# Altium schematic sheet 05_OSC_PLL.SchDoc: =title
size A3; Organization: 六零加智能科技; Address4: www.nidone.com.cn; DocumentNumber: kang jin; Revision: 1.0; SheetNumber: 5; SheetTotal: 23
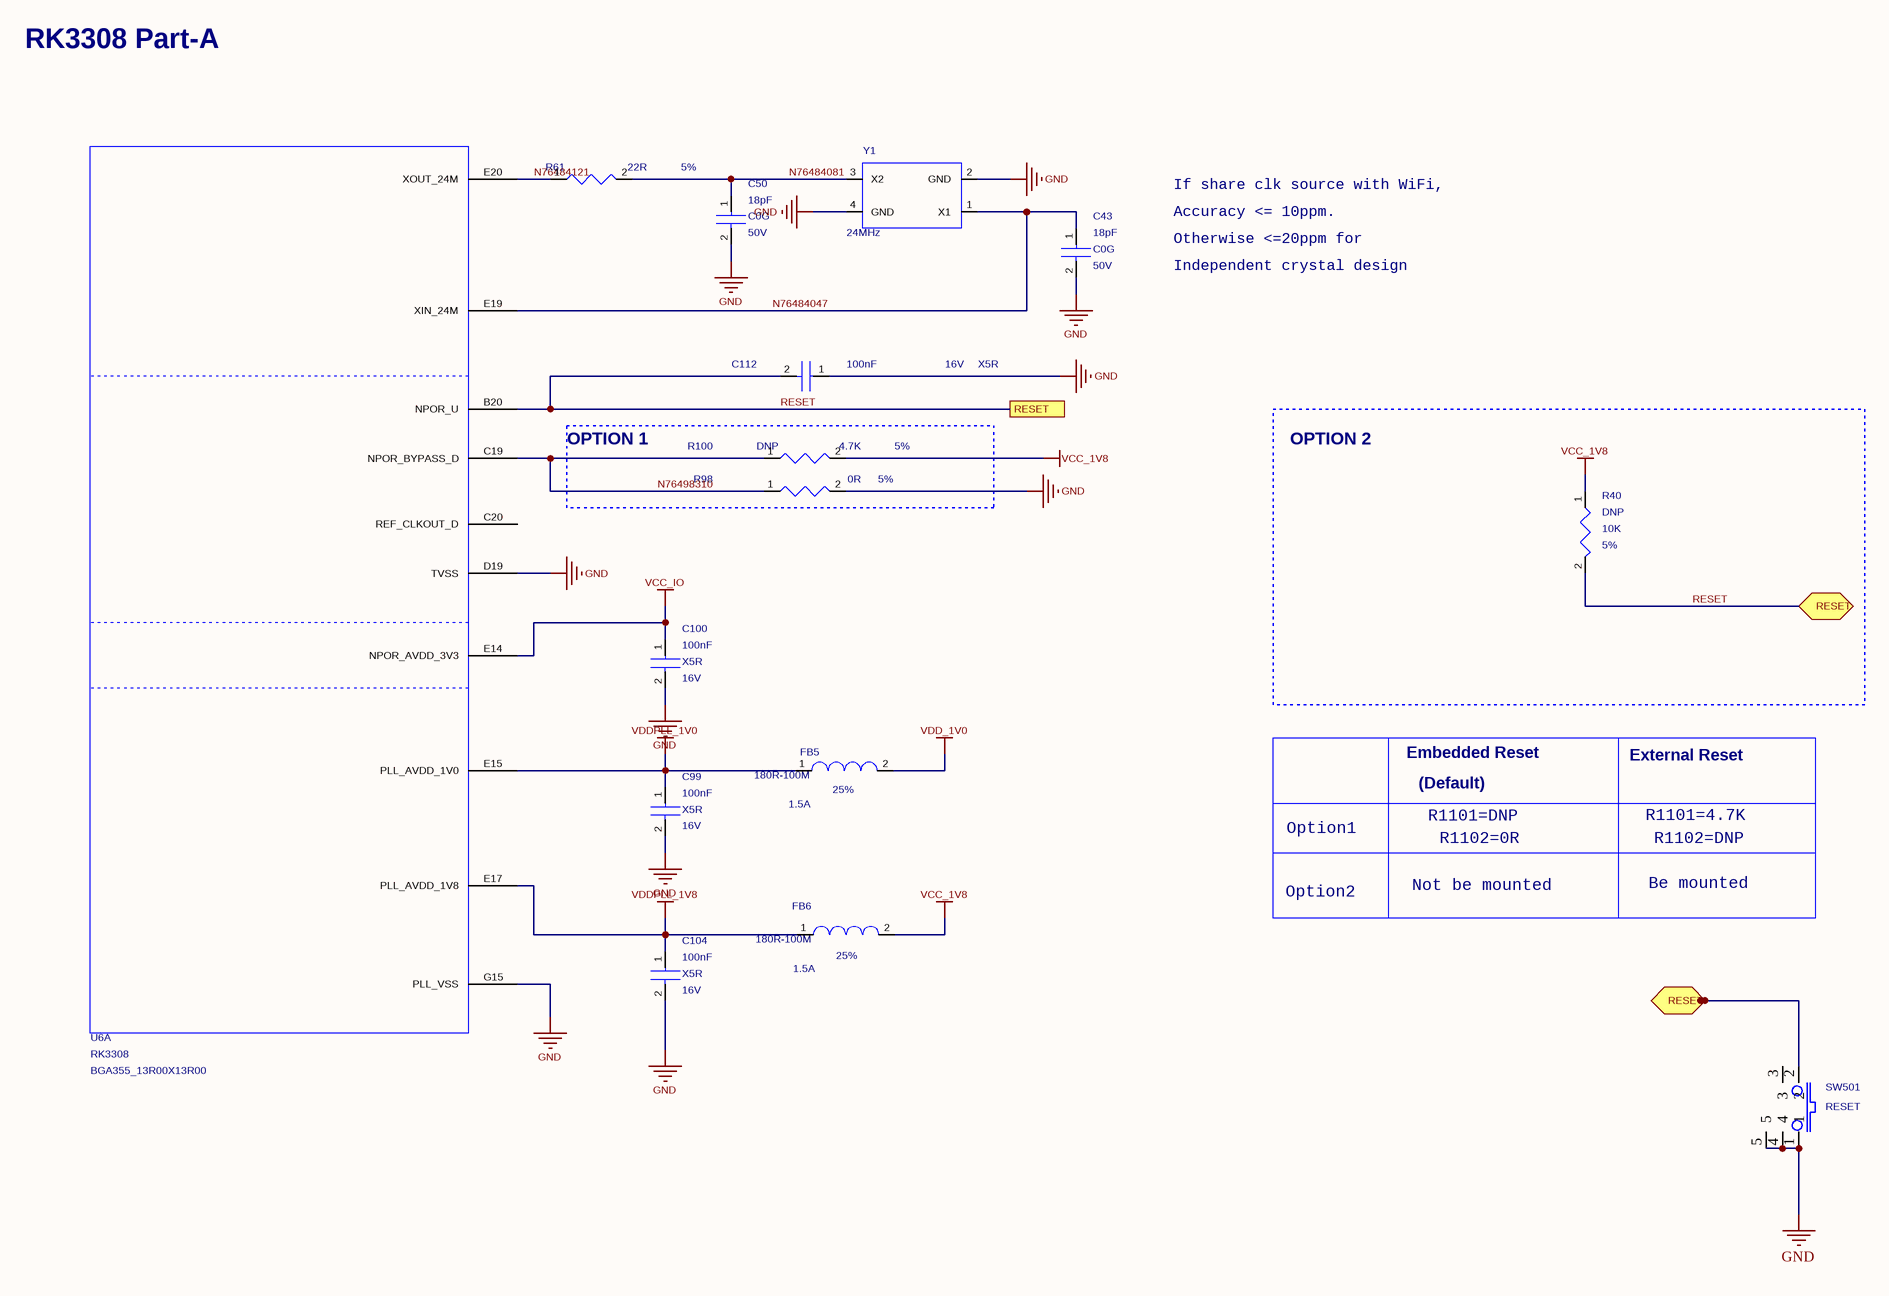
[diagram p0: 05_OSC_PLL.SchDoc]

## Parts
C43  value 18pF  Dielectric: C0G  Voltage: 50V  [C0402]  (hidden comment: CAP_NP_2)
C50  value 18pF  Dielectric: C0G  Voltage: 50V  [C0402]  (hidden comment: CAP_NP_2)
C99  value 100nF  Voltage: 16V  Dielectric: X5R  [C0402]  (hidden comment: CAP_NP_2)
C100  value 100nF  Voltage: 16V  Dielectric: X5R  [C0402]  (hidden comment: CAP_NP_2)
C104  value 100nF  Voltage: 16V  Dielectric: X5R  [C0402]  (hidden comment: CAP_NP_2)
C112  value 100nF  Dielectric: X5R  Voltage: 16V  [C0402]  (hidden comment: CAP_NP_2)
FB5  value 180R-100M  Tolerance: 25%  Irms: 1.5A  [L0603]  (hidden comment: BEAD)
FB6  value 180R-100M  Tolerance: 25%  Irms: 1.5A  [L0603]  (hidden comment: BEAD)
R40  value 10K  OPTION: DNP  Tolerance: 5%  [R0402]  (hidden comment: RESISTOR)
R61  value 22R  Tolerance: 5%  [R0402]  (hidden comment: RESISTOR)
R98  value 0R  Tolerance: 5%  [R0402]  (hidden comment: RESISTOR)
R100  value 4.7K  Tolerance: 5%  OPTION: DNP  [R0402]  (hidden comment: RESISTOR)
SW501  RESET  [SW-TS]
U6  RK3308  [BGA355_13R00X13R00]  (part A of 14)
Y1  value 24MHz  [CRY4_3R20X2R50X0R80]  (hidden comment: CRYSTAL_4P)

## Blocks framed on the sheet
OPTION 2: R40
OPTION 1: R98 R100

## Ports
RESET, RESET (bidir)

## Nets
GND: C43.2 C50.2 C99.2 C100.2 C104.2 C112.1 R98.2 SW501.1 SW501.4 SW501.5 U6.D19(TVSS) U6.G15(PLL_VSS) Y1.2(GND) Y1.4(GND)
VCC_1V8: FB6.2 R40.1 R100.2
VCC_IO: C100.1 U6.E14(NPOR_AVDD_3V3)
VDD_1V0: FB5.2
VDDPLL_1V0: C99.1 FB5.1 U6.E15(PLL_AVDD_1V0)
VDDPLL_1V8: C104.1 FB6.1 U6.E17(PLL_AVDD_1V8)
N76484047: C43.1 U6.E19(XIN_24M) Y1.1(X1)
N76484081: C50.1 R61.2 Y1.3(X2)
N76484121: R61.1 U6.E20(XOUT_24M)
N76498310: R98.1 R100.1 U6.C19(NPOR_BYPASS_D)
RESET: C112.2 R40.2 SW501.2 U6.B20(NPOR_U) ; port RESET

Not connected (* = marked no-connect by the designer): SW501 3; U6 C20(REF_CLKOUT_D)

## Notes on the sheet
- RK3308 Part-A
- If share clk source with WiFi,
- Accuracy <= 10ppm.
- Otherwise <=20ppm for
- Independent crystal design
- Embedded Reset
- External Reset
- Option1
- (Default)
- R1101=DNP
- R1102=0R
- R1101=4.7K
- R1102=DNP
- Option2
- Not be mounted
- Be mounted
- Title
- Size:
- Date:
- A3
- Engineer:
- Time:
- Revision:
- Sheet
- of
- File:

## Library data of the parts
C43 C50 = CAP_NP_2: cap,18.00pF,+/-5%,50V,C0G,C0402; Manufacturer: TDK; RK_PN: C1005C0G1H180J050BA; Priority: A; Tolerance: 5%; Created_by: JJJ; Source_Path: Z:\RK_STANDARD_LIBRARY\CADENCE_CIS\RK_DISCRETE.OLB; PCB DECAL: C0402; Part_Type: C0402; C_Voltage: 50V; Manufacturer_PN: C1005C0G1H180J050BA
C99 C100 C104 = CAP_NP_2: cap,100.00nF,+/-10%,16V,X5R,C0402; Manufacturer_PN: C1005X5R1C104K050BA; Manufacturer: TDK; Created_by: JJJ; Tolerance: 10%; Priority: A; Source_Path: Z:\RK_STANDARD_LIBRARY\CADENCE_CIS\RK_DISCRETE.OLB; Number: 1; PCB DECAL: C0402; Part_Type: C0402; RK_PN: C1005X5R1C104K050BA
C112 = CAP_NP_2: cap,100.00nF,+/-10%,16V,X5R,C0402; Manufacturer: TDK; RK_PN: C1005X5R1C104K050BA; Priority: A; Tolerance: 10%; Created_by: JJJ; Source_Path: Z:\RK_STANDARD_LIBRARY\CADENCE_CIS\RK_DISCRETE.OLB; Number: 1; PCB DECAL: C0402; Part_Type: C0402; Manufacturer_PN: C1005X5R1C104K050BA
FB5 FB6 = BEAD: Ferrite Bead,180R-100M,0.25,L0603; Manufacturer: Murata; RK_PN: BLM18PG181SN1; Priority: A; DC_Resistor: 0.09ohm; Created_by: YTL; Source_Path: Z:\RK_STANDARD_LIBRARY\CADENCE_CIS\RK_DISCRETE.OLB; PCB DECAL: L0603; Part_Type: BEAD; Manufacturer_PN: BLM18PG181SN1
R40 = RESISTOR: ?用厚膜电阻,10K,+/-5%,R0402,1/16W.; Manufacturer_PN: RC0402JR-0710KL; Manufacturer: YAGEO; Created_by: YTL; Wattage: 1/16W; Priority: A; Source_Path: Z:\RK_STANDARD_LIBRARY\CADENCE_CIS\RK_DISCRETE.OLB; PCB DECAL: R0402; Part_Type: ?用厚膜电阻; RK_PN: RC0402JR-0710KL
R61 = RESISTOR: ?用厚膜电阻,22R,+/-5%,R0402,1/16W.; Manufacturer_PN: RC0402JR-0722RL; Manufacturer: YAGEO; Created_by: YTL; Wattage: 1/16W; Priority: A; Source_Path: Z:\RK_STANDARD_LIBRARY\CADENCE_CIS\RK_DISCRETE.OLB; number: 1; PCB DECAL: R0402; Part_Type: ?用厚膜电阻; RK_PN: RC0402JR-0722RL
R98 = RESISTOR: ?用厚膜电阻,0R,+/-5%,R0402,1/16W.; Manufacturer_PN: RC0402JR-070RL; Manufacturer: YAGEO; Created_by: YTL; Wattage: 1/16W; Priority: A; Source_Path: Z:\RK_STANDARD_LIBRARY\CADENCE_CIS\RK_DISCRETE.OLB; Number: 1; PCB DECAL: R0402; Part_Type: ?用厚膜电阻; RK_PN: RC0402JR-070RL
R100 = RESISTOR: ?用厚膜电阻,4K7,+/-5%,R0402,1/16W.; Manufacturer_PN: RC0402JR-074K7L; Manufacturer: YAGEO; Created_by: YTL; Wattage: 1/16W; Priority: A; Source_Path: Z:\RK_STANDARD_LIBRARY\CADENCE_CIS\RK_DISCRETE.OLB; PCB DECAL: R0402; Part_Type: ?用厚膜电阻; RK_PN: RC0402JR-074K7L
SW501 = KEY_5PIN: TS-1086EV-AR03526; pin to pad: 1>2 2>1; Manufacturer: 褀华电子; RK PN: TS-1125S; Priority: A; Part Type: KEY; Manufacturer Part Number: TS-1125S; Created by: YWQ
U6 = RK3308: Manufacturer: ROCKCHIP; Source_Path: E:\SCHEMETIC\RKSCH.OLB; Number: 1; PCB DECAL: BGA355_13R00X13R00; Value: RK3308; Manufacturer_PN: RK3308
Y1 = CRYSTAL_4P: 无源晶振，24M，3225,±10ppm，12pF，Hosonic; Manufacturer: Hosonic(鸿星电子); RK_PN: E3SB24.0000F12E11; Priority: A; Created_by: JJJ; Source_Path: Z:\RK_STANDARD_LIBRARY\CADENCE_CIS\RK_DISCRETE.OLB; Number: 1; PCB DECAL: CRY4_3R20X2R50X0R80; Part_Type: CRYSTAL; Manufacturer_PN: E3SB24.0000F12E11